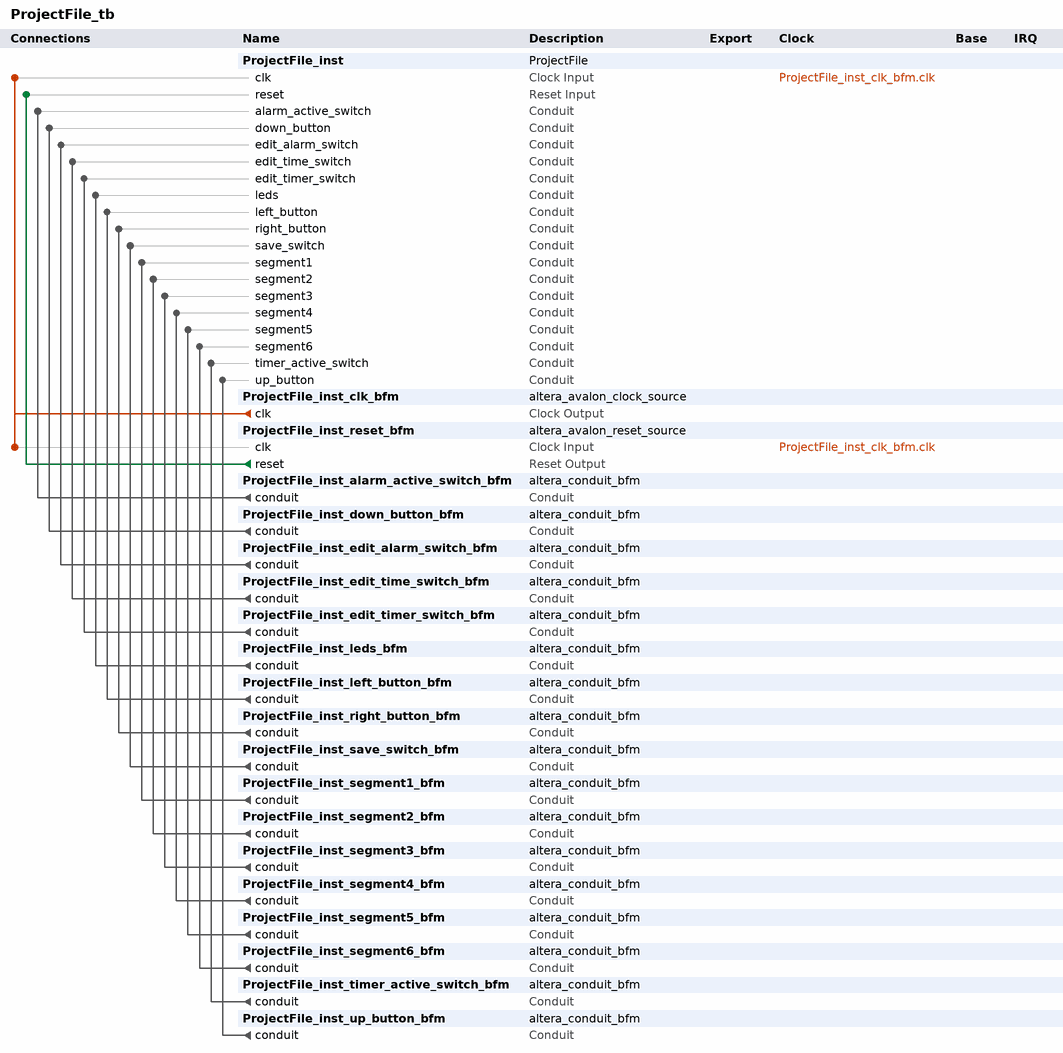
[diagram p0: system contents]
# Platform Designer (Qsys) system ProjectFile_tb, Cyclone V 5CSEMA5F31C6
# Parameters at their usual value, and those the tool derives, are not listed.
package require -exact qsys 20.1
create_system ProjectFile_tb
set_project_property DEVICE_FAMILY {Cyclone V}
set_project_property DEVICE 5CSEMA5F31C6

add_instance ProjectFile_inst ProjectFile 1.0

add_instance ProjectFile_inst_clk_bfm altera_avalon_clock_source 20.1

add_instance ProjectFile_inst_reset_bfm altera_avalon_reset_source 20.1
set_instance_parameter_value ProjectFile_inst_reset_bfm ASSERT_HIGH_RESET 0
set_instance_parameter_value ProjectFile_inst_reset_bfm INITIAL_RESET_CYCLES 50

add_instance ProjectFile_inst_alarm_active_switch_bfm altera_conduit_bfm 20.1
set_instance_parameter_value ProjectFile_inst_alarm_active_switch_bfm CLOCKED_SIGNAL false
set_instance_parameter_value ProjectFile_inst_alarm_active_switch_bfm ENABLE_RESET false
set_instance_parameter_value ProjectFile_inst_alarm_active_switch_bfm SIGNAL_DIRECTIONS output
set_instance_parameter_value ProjectFile_inst_alarm_active_switch_bfm SIGNAL_WIDTHS 1

add_instance ProjectFile_inst_down_button_bfm altera_conduit_bfm 20.1
set_instance_parameter_value ProjectFile_inst_down_button_bfm CLOCKED_SIGNAL false
set_instance_parameter_value ProjectFile_inst_down_button_bfm ENABLE_RESET false
set_instance_parameter_value ProjectFile_inst_down_button_bfm SIGNAL_DIRECTIONS output
set_instance_parameter_value ProjectFile_inst_down_button_bfm SIGNAL_WIDTHS 1

add_instance ProjectFile_inst_edit_alarm_switch_bfm altera_conduit_bfm 20.1
set_instance_parameter_value ProjectFile_inst_edit_alarm_switch_bfm CLOCKED_SIGNAL false
set_instance_parameter_value ProjectFile_inst_edit_alarm_switch_bfm ENABLE_RESET false
set_instance_parameter_value ProjectFile_inst_edit_alarm_switch_bfm SIGNAL_DIRECTIONS output
set_instance_parameter_value ProjectFile_inst_edit_alarm_switch_bfm SIGNAL_WIDTHS 1

add_instance ProjectFile_inst_edit_time_switch_bfm altera_conduit_bfm 20.1
set_instance_parameter_value ProjectFile_inst_edit_time_switch_bfm CLOCKED_SIGNAL false
set_instance_parameter_value ProjectFile_inst_edit_time_switch_bfm ENABLE_RESET false
set_instance_parameter_value ProjectFile_inst_edit_time_switch_bfm SIGNAL_DIRECTIONS output
set_instance_parameter_value ProjectFile_inst_edit_time_switch_bfm SIGNAL_WIDTHS 1

add_instance ProjectFile_inst_edit_timer_switch_bfm altera_conduit_bfm 20.1
set_instance_parameter_value ProjectFile_inst_edit_timer_switch_bfm CLOCKED_SIGNAL false
set_instance_parameter_value ProjectFile_inst_edit_timer_switch_bfm ENABLE_RESET false
set_instance_parameter_value ProjectFile_inst_edit_timer_switch_bfm SIGNAL_DIRECTIONS output
set_instance_parameter_value ProjectFile_inst_edit_timer_switch_bfm SIGNAL_WIDTHS 1

add_instance ProjectFile_inst_leds_bfm altera_conduit_bfm 20.1
set_instance_parameter_value ProjectFile_inst_leds_bfm CLOCKED_SIGNAL false
set_instance_parameter_value ProjectFile_inst_leds_bfm ENABLE_RESET false
set_instance_parameter_value ProjectFile_inst_leds_bfm SIGNAL_DIRECTIONS input
set_instance_parameter_value ProjectFile_inst_leds_bfm SIGNAL_WIDTHS 10

add_instance ProjectFile_inst_left_button_bfm altera_conduit_bfm 20.1
set_instance_parameter_value ProjectFile_inst_left_button_bfm CLOCKED_SIGNAL false
set_instance_parameter_value ProjectFile_inst_left_button_bfm ENABLE_RESET false
set_instance_parameter_value ProjectFile_inst_left_button_bfm SIGNAL_DIRECTIONS output
set_instance_parameter_value ProjectFile_inst_left_button_bfm SIGNAL_WIDTHS 1

add_instance ProjectFile_inst_right_button_bfm altera_conduit_bfm 20.1
set_instance_parameter_value ProjectFile_inst_right_button_bfm CLOCKED_SIGNAL false
set_instance_parameter_value ProjectFile_inst_right_button_bfm ENABLE_RESET false
set_instance_parameter_value ProjectFile_inst_right_button_bfm SIGNAL_DIRECTIONS output
set_instance_parameter_value ProjectFile_inst_right_button_bfm SIGNAL_WIDTHS 1

add_instance ProjectFile_inst_save_switch_bfm altera_conduit_bfm 20.1
set_instance_parameter_value ProjectFile_inst_save_switch_bfm CLOCKED_SIGNAL false
set_instance_parameter_value ProjectFile_inst_save_switch_bfm ENABLE_RESET false
set_instance_parameter_value ProjectFile_inst_save_switch_bfm SIGNAL_DIRECTIONS output
set_instance_parameter_value ProjectFile_inst_save_switch_bfm SIGNAL_WIDTHS 1

add_instance ProjectFile_inst_segment1_bfm altera_conduit_bfm 20.1
set_instance_parameter_value ProjectFile_inst_segment1_bfm CLOCKED_SIGNAL false
set_instance_parameter_value ProjectFile_inst_segment1_bfm ENABLE_RESET false
set_instance_parameter_value ProjectFile_inst_segment1_bfm SIGNAL_DIRECTIONS input
set_instance_parameter_value ProjectFile_inst_segment1_bfm SIGNAL_WIDTHS 8

add_instance ProjectFile_inst_segment2_bfm altera_conduit_bfm 20.1
set_instance_parameter_value ProjectFile_inst_segment2_bfm CLOCKED_SIGNAL false
set_instance_parameter_value ProjectFile_inst_segment2_bfm ENABLE_RESET false
set_instance_parameter_value ProjectFile_inst_segment2_bfm SIGNAL_DIRECTIONS input
set_instance_parameter_value ProjectFile_inst_segment2_bfm SIGNAL_WIDTHS 8

add_instance ProjectFile_inst_segment3_bfm altera_conduit_bfm 20.1
set_instance_parameter_value ProjectFile_inst_segment3_bfm CLOCKED_SIGNAL false
set_instance_parameter_value ProjectFile_inst_segment3_bfm ENABLE_RESET false
set_instance_parameter_value ProjectFile_inst_segment3_bfm SIGNAL_DIRECTIONS input
set_instance_parameter_value ProjectFile_inst_segment3_bfm SIGNAL_WIDTHS 8

add_instance ProjectFile_inst_segment4_bfm altera_conduit_bfm 20.1
set_instance_parameter_value ProjectFile_inst_segment4_bfm CLOCKED_SIGNAL false
set_instance_parameter_value ProjectFile_inst_segment4_bfm ENABLE_RESET false
set_instance_parameter_value ProjectFile_inst_segment4_bfm SIGNAL_DIRECTIONS input
set_instance_parameter_value ProjectFile_inst_segment4_bfm SIGNAL_WIDTHS 8

add_instance ProjectFile_inst_segment5_bfm altera_conduit_bfm 20.1
set_instance_parameter_value ProjectFile_inst_segment5_bfm CLOCKED_SIGNAL false
set_instance_parameter_value ProjectFile_inst_segment5_bfm ENABLE_RESET false
set_instance_parameter_value ProjectFile_inst_segment5_bfm SIGNAL_DIRECTIONS input
set_instance_parameter_value ProjectFile_inst_segment5_bfm SIGNAL_WIDTHS 8

add_instance ProjectFile_inst_segment6_bfm altera_conduit_bfm 20.1
set_instance_parameter_value ProjectFile_inst_segment6_bfm CLOCKED_SIGNAL false
set_instance_parameter_value ProjectFile_inst_segment6_bfm ENABLE_RESET false
set_instance_parameter_value ProjectFile_inst_segment6_bfm SIGNAL_DIRECTIONS input
set_instance_parameter_value ProjectFile_inst_segment6_bfm SIGNAL_WIDTHS 8

add_instance ProjectFile_inst_timer_active_switch_bfm altera_conduit_bfm 20.1
set_instance_parameter_value ProjectFile_inst_timer_active_switch_bfm CLOCKED_SIGNAL false
set_instance_parameter_value ProjectFile_inst_timer_active_switch_bfm ENABLE_RESET false
set_instance_parameter_value ProjectFile_inst_timer_active_switch_bfm SIGNAL_DIRECTIONS output
set_instance_parameter_value ProjectFile_inst_timer_active_switch_bfm SIGNAL_WIDTHS 1

add_instance ProjectFile_inst_up_button_bfm altera_conduit_bfm 20.1
set_instance_parameter_value ProjectFile_inst_up_button_bfm CLOCKED_SIGNAL false
set_instance_parameter_value ProjectFile_inst_up_button_bfm ENABLE_RESET false
set_instance_parameter_value ProjectFile_inst_up_button_bfm SIGNAL_DIRECTIONS output
set_instance_parameter_value ProjectFile_inst_up_button_bfm SIGNAL_WIDTHS 1

# connections
add_connection ProjectFile_inst_clk_bfm.clk ProjectFile_inst.clk clock
add_connection ProjectFile_inst_clk_bfm.clk ProjectFile_inst_reset_bfm.clk clock
add_connection ProjectFile_inst_reset_bfm.reset ProjectFile_inst.reset reset
add_connection ProjectFile_inst_alarm_active_switch_bfm.conduit ProjectFile_inst.alarm_active_switch conduit
add_connection ProjectFile_inst_down_button_bfm.conduit ProjectFile_inst.down_button conduit
add_connection ProjectFile_inst_edit_alarm_switch_bfm.conduit ProjectFile_inst.edit_alarm_switch conduit
add_connection ProjectFile_inst_edit_time_switch_bfm.conduit ProjectFile_inst.edit_time_switch conduit
add_connection ProjectFile_inst_edit_timer_switch_bfm.conduit ProjectFile_inst.edit_timer_switch conduit
add_connection ProjectFile_inst_leds_bfm.conduit ProjectFile_inst.leds conduit
add_connection ProjectFile_inst_left_button_bfm.conduit ProjectFile_inst.left_button conduit
add_connection ProjectFile_inst_right_button_bfm.conduit ProjectFile_inst.right_button conduit
add_connection ProjectFile_inst_save_switch_bfm.conduit ProjectFile_inst.save_switch conduit
add_connection ProjectFile_inst_segment1_bfm.conduit ProjectFile_inst.segment1 conduit
add_connection ProjectFile_inst_segment2_bfm.conduit ProjectFile_inst.segment2 conduit
add_connection ProjectFile_inst_segment3_bfm.conduit ProjectFile_inst.segment3 conduit
add_connection ProjectFile_inst_segment4_bfm.conduit ProjectFile_inst.segment4 conduit
add_connection ProjectFile_inst_segment5_bfm.conduit ProjectFile_inst.segment5 conduit
add_connection ProjectFile_inst_segment6_bfm.conduit ProjectFile_inst.segment6 conduit
add_connection ProjectFile_inst_timer_active_switch_bfm.conduit ProjectFile_inst.timer_active_switch conduit
add_connection ProjectFile_inst_up_button_bfm.conduit ProjectFile_inst.up_button conduit

set_interconnect_requirement {$system} qsys_mm.clockCrossingAdapter HANDSHAKE
set_interconnect_requirement {$system} qsys_mm.enableEccProtection FALSE
set_interconnect_requirement {$system} qsys_mm.insertDefaultSlave FALSE
set_interconnect_requirement {$system} qsys_mm.maxAdditionalLatency 1

save_system ProjectFile_tb.qsys
